# EAGLE design TapTempoMk2 (EAGLE 7.5.0)
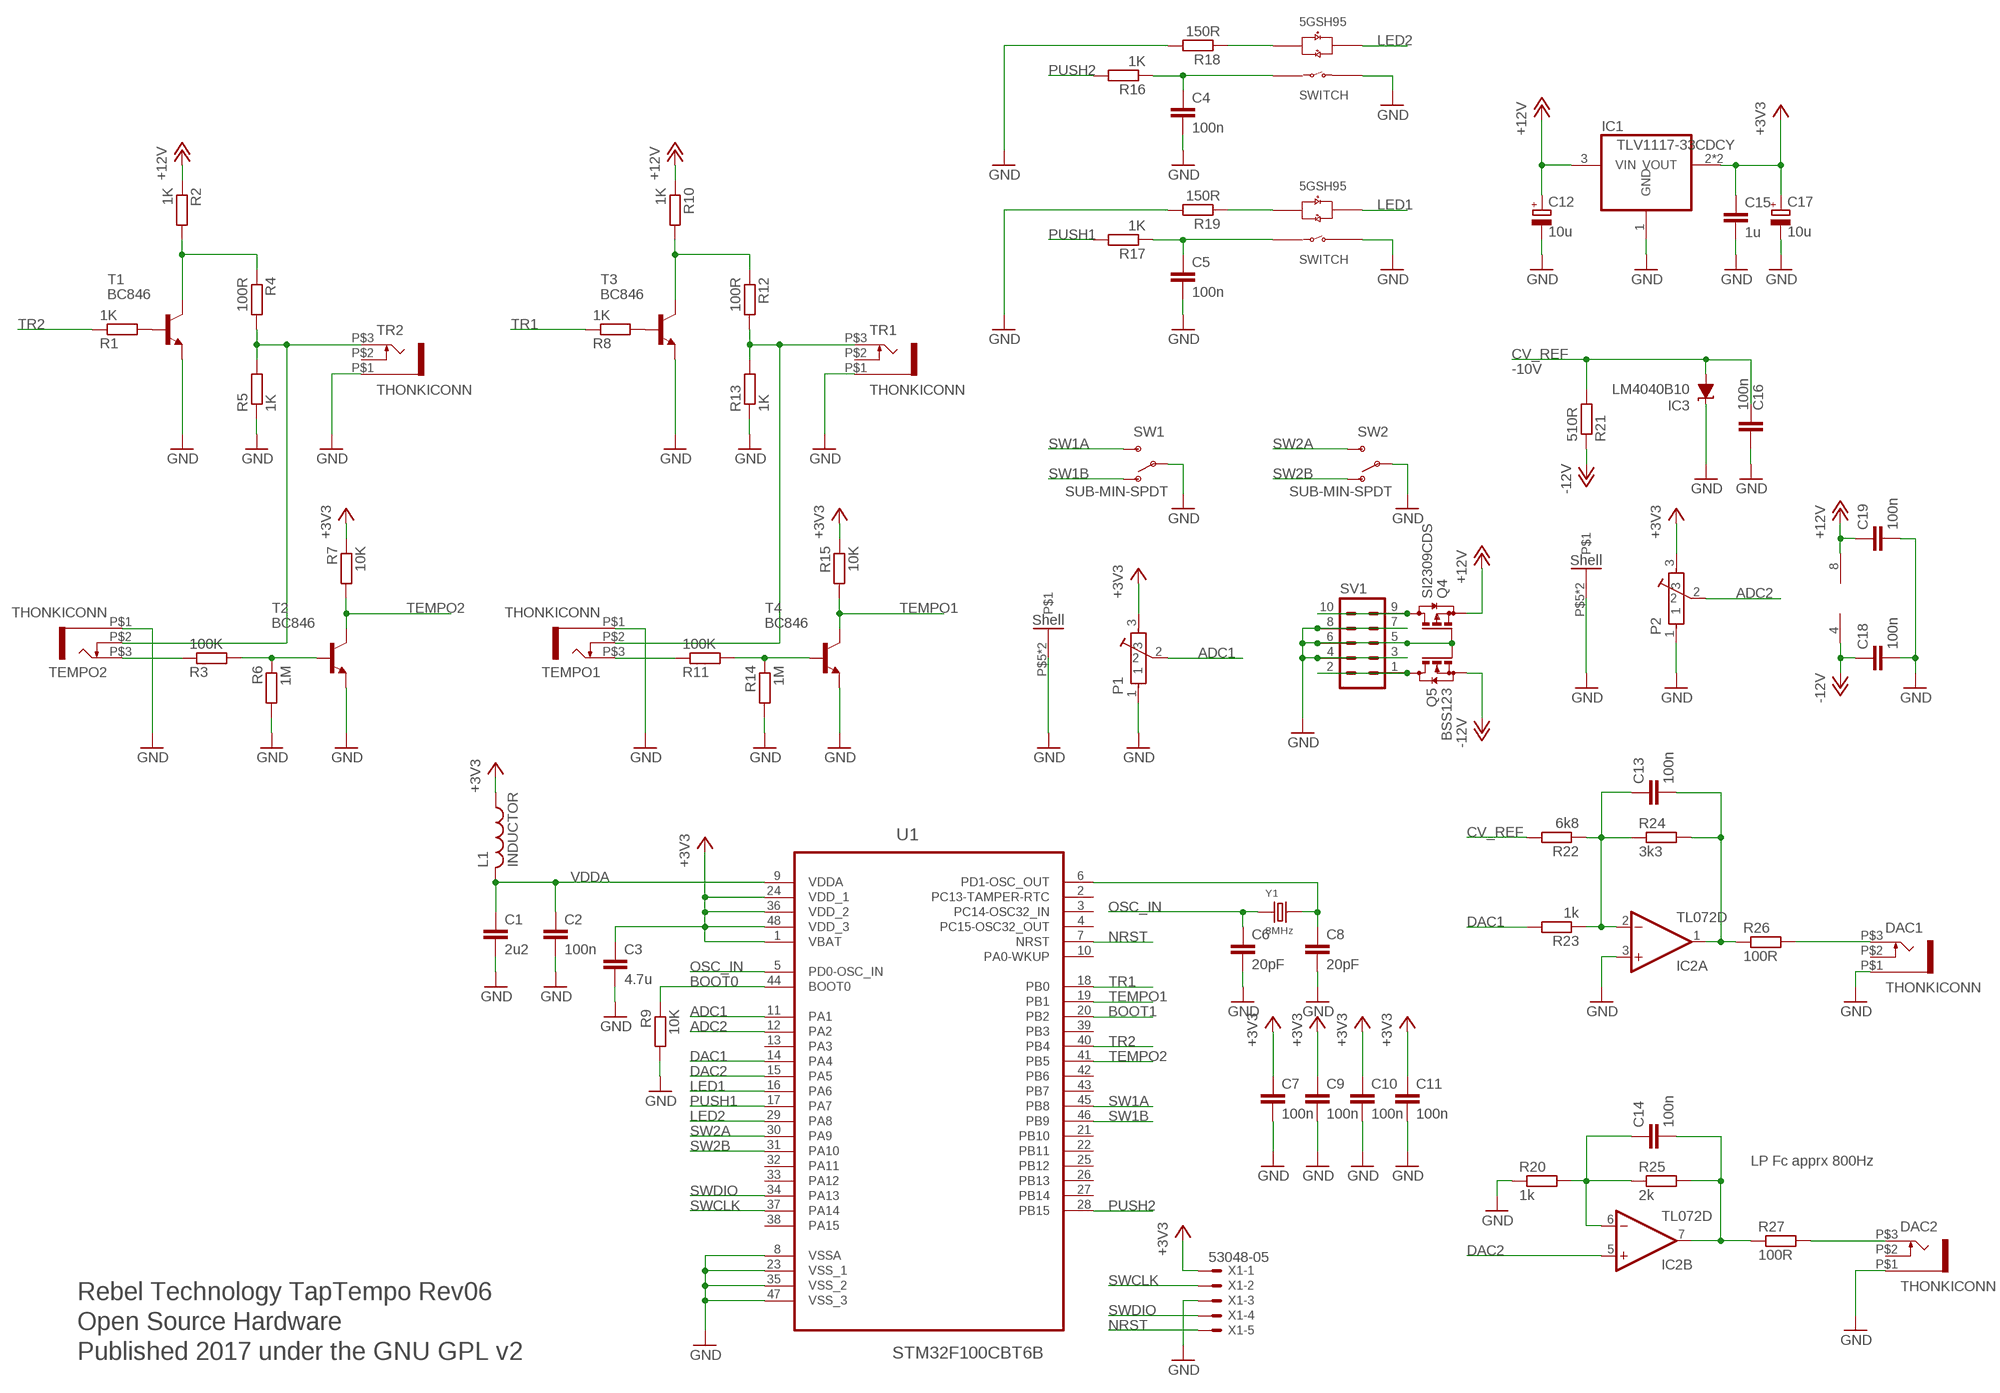
[diagram p0: schematic, sheet 1]

## Parts
C1  2u2  C-EUC0603  [C0603]
C2  100n  C-EUC0603  [C0603]
C3  4.7u  C-EUC0603  [C0603]
C4  100n  C-EUC0603  [C0603]
C5  100n  C-EUC0603  [C0603]
C6  20pF  C-EUC0603  [C0603]
C7  100n  C-EUC0603  [C0603]
C8  20pF  C-EUC0603  [C0603]
C9  100n  C-EUC0603  [C0603]
C10  100n  C-EUC0603  [C0603]
C11  100n  C-EUC0603  [C0603]
C12  10u  CPOL-EU153CLV-0405  [153CLV-0405]
C13  100n  C-EUC0603  [C0603]
C14  100n  C-EUC0603  [C0603]
C15  1u  C-EUC0603  [C0603]
C16  100n  C-EUC0603  [C0603]
C17  10u  CPOL-EU153CLV-0405  [153CLV-0405]
C18  100n  C-EUC0603  [C0603]
C19  100n  C-EUC0603  [C0603]
DAC1  THONKICONN  [THONKICONN]
DAC2  THONKICONN  [THONKICONN]
IC1  TLV1117-33CDCY  REG1117  [SOT223]
IC2  TL072D  [SO08]
IC3  LM4040B10  LM4041C12DBZ  [DBZ_R-PDSO-G3]
L1  INDUCTOR  [0603]
P1  POT-ALPS-RK09L1140  [POT-ALPS-RK09L1140]
P2  POT-ALPS-RK09L1140  [POT-ALPS-RK09L1140]
PUSH1  5GTH9  [5GTH9]
PUSH2  5GTH9  [5GTH9]
Q4  SI2309CDS  BSS84  [SOT23]
Q5  BSS123  [SOT23]
R1  1K  R-EU_0603  [0603]
R2  1K  R-EU_0603  [0603]
R3  100K  R-EU_0603  [0603]
R4  100R  R-EU_0603  [0603]
R5  1K  R-EU_0603  [0603]
R6  1M  R-EU_0603  [0603]
R7  10K  R-EU_0603  [0603]
R8  1K  R-EU_0603  [0603]
R9  10K  R-EU_0603  [0603]
R10  1K  R-EU_0603  [0603]
R11  100K  R-EU_0603  [0603]
R12  100R  R-EU_0603  [0603]
R13  1K  R-EU_0603  [0603]
R14  1M  R-EU_0603  [0603]
R15  10K  R-EU_0603  [0603]
R16  1K  R-EU_0603  [0603]
R17  1K  R-EU_0603  [0603]
R18  150R  R-EU_0603  [0603]
R19  150R  R-EU_0603  [0603]
R20  1k  R-EU_0603  [0603]
R21  510R  R-EU_0603  [0603]
R22  6k8  R-EU_0603  [0603]
R23  1k  R-EU_0603  [0603]
R24  3k3  R-EU_0603  [0603]
R25  2k  R-EU_0603  [0603]
R26  100R  R-EU_0603  [0603]
R27  100R  R-EU_0603  [0603]
SV1  MA05-2  [MA05-2]
SW1  SUB-MIN-SPDT  [SUB-MIN-SPDT]
SW2  SUB-MIN-SPDT  [SUB-MIN-SPDT]
T1  BC846  [SOT23]
T2  BC846  [SOT23]
T3  BC846  [SOT23]
T4  BC846  [SOT23]
TEMPO1  THONKICONN  [THONKICONN]
TEMPO2  THONKICONN  [THONKICONN]
TR1  THONKICONN  [THONKICONN]
TR2  THONKICONN  [THONKICONN]
U1  STM32F100CBT6B  [QFP50P900X900X160-48N]
X1  53048-05  [53048-05]
Y1  8MHz  SMD-CRYSTAL-8MHZ-20PF-20PPM(2P-5.0X3.2MM)  [X2-SMD-5.0X3.2X1.3MM]

## Nets
+3V3: C3.1 C7.1 C9.1 C10.1 C11.1 C15.1 C17.+ IC1.2(VOUT) IC1.4(VOUT) L1.1 P1.3 P2.3 R7.1 R15.1 U1.1(VBAT) U1.24(VDD_1) U1.36(VDD_2) U1.48(VDD_3) X1.1
+12V: C12.+ C19.1 IC1.3(VIN) IC2.8(P:V+) Q4.2(S) R2.1 R10.1
-12V: C18.1 IC2.4(P:V-) Q5.2(S) R21.1
ADC1: P1.2 U1.11(PA1)
ADC2: P2.2 U1.12(PA2)
BOOT0: R9.1 U1.44(BOOT0)
BOOT1: U1.20(PB2)
CV_REF: C16.1 IC3.2(A) R21.2 R22.2
DAC1: R23.2 U1.14(PA4)
DAC2: IC2.5(B:+IN) U1.15(PA5)
GND: C1.2 C2.2 C3.2 C4.2 C5.2 C6.2 C7.2 C8.2 C9.2 C10.2 C11.2 C12.- C15.2 C16.2 C17.- C18.2 C19.2 DAC1.P$1 DAC2.P$1 IC1.1(GND) IC2.3(A:+IN) IC3.1(C) P1.1 P1.P$5 P1.P$6 P2.1 P2.P$5 P2.P$6 PUSH1.1(SWITCH_B) PUSH2.1(SWITCH_B) Q4.1(G) Q5.1(G) R5.1 R6.2 R9.2 R13.1 R14.2 R18.2 R19.2 R20.1 SV1.3 SV1.4 SV1.5 SV1.6 SV1.7 SV1.8 SW1.2(P) SW2.2(P) T1.2(E) T2.2(E) T3.2(E) T4.2(E) TEMPO1.P$1 TEMPO2.P$1 TR1.P$1 TR2.P$1 U1.8(VSSA) U1.23(VSS_1) U1.35(VSS_2) U1.47(VSS_3) X1.3
LED1: PUSH1.+3(LED_R+) U1.16(PA6)
LED2: PUSH2.+3(LED_R+) U1.29(PA8)
N$1: C8.1 U1.6(PD1-OSC_OUT) Y1.2
N$2: PUSH1.-2(LED_G+) R19.1
N$3: C14.2 IC2.7(B:OUT) R25.2 R27.1
N$4: C14.1 IC2.6(B:-IN) R20.2 R25.1
N$5: R12.2 R13.2 TEMPO1.P$2 TR1.P$3
N$6: Q4.3(D) SV1.9 SV1.10
N$7: C13.2 IC2.1(A:OUT) R24.2 R26.1
N$9: PUSH2.-2(LED_G+) R18.1
N$10: R3.2 R6.1 T2.1(B)
N$11: R1.2 T1.1(B)
N$12: R2.2 R4.1 T1.3(C)
N$13: C13.1 IC2.2(A:-IN) R22.1 R23.1 R24.1
N$14: R3.1 TEMPO2.P$3
N$15: R4.2 R5.2 TEMPO2.P$2 TR2.P$3
N$16: Q5.3(D) SV1.1 SV1.2
N$17: C5.1 PUSH1.4(SWITCH_A) R17.1
N$18: C4.1 PUSH2.4(SWITCH_A) R16.1
N$23: R11.1 TEMPO1.P$3
N$27: R11.2 R14.1 T4.1(B)
N$31: DAC1.P$3 R26.2
N$32: DAC2.P$3 R27.2
N$34: R8.2 T3.1(B)
N$38: R10.2 R12.1 T3.3(C)
NRST: U1.7(NRST) X1.5
OSC_IN: C6.1 U1.5(PD0-OSC_IN) Y1.1
PUSH1: R17.2 U1.17(PA7)
PUSH2: R16.2 U1.28(PB15)
SW1A: SW1.3(S) U1.45(PB8)
SW1B: SW1.1(O) U1.46(PB9)
SW2A: SW2.3(S) U1.30(PA9)
SW2B: SW2.1(O) U1.31(PA10)
SWCLK: U1.37(PA14) X1.2
SWDIO: U1.34(PA13) X1.4
TEMPO1: R15.2 T4.3(C) U1.19(PB1)
TEMPO2: R7.2 T2.3(C) U1.41(PB5)
TR1: R8.1 U1.18(PB0)
TR2: R1.1 U1.40(PB4)
VDDA: C1.1 C2.1 L1.2 U1.9(VDDA)
Unconnected: DAC1.P$2 DAC2.P$2 TR1.P$2 TR2.P$2 U1.2(PC13-TAMPER-RTC) U1.3(PC14-OSC32_IN) U1.4(PC15-OSC32_OUT) U1.10(PA0-WKUP) U1.13(PA3) U1.21(PB10) U1.22(PB11) U1.25(PB12) U1.26(PB13) U1.27(PB14) U1.32(PA11) U1.33(PA12) U1.38(PA15) U1.39(PB3) U1.42(PB6) U1.43(PB7)

## Notes on the sheet
- -10V
- LP Fc apprx 800Hz
- Rebel Technology TapTempo Rev06
- Open Source Hardware
- Published 2017 under the GNU GPL v2

## Library data of the parts
C1-C11 C13-C16 C18 C19 = Rebel:C-EU: CAPACITOR, European symbol
C12 C17 = Rebel:CPOL-EU: POLARIZED CAPACITOR, European symbol; FARNELL: 882-3014
DAC1 DAC2 TEMPO1 TEMPO2 TR1 TR2 = Rebel:THONKICONN
IC1 = burr-brown:REG1117: 800mA and 1A Low Dropout (LDO) Positive Regulator 1.8V, 2.5V, 2.85V, 3.3V, 5V, and Adj; FARNELL: 149-4942; MPN: REG1117; OC_FARNELL: 1097566; OC_NEWARK: 14P6981
IC2 = linear:TL072: OP AMP
IC3 = texas:LM4041: PRECISION MICROPOWER SHUNT VOLTAGE REFERENCE Source: http://focus.ti.com/lit/ds/slcs146e/slcs146e.pdf; MF: TEXAS INSTRUMENT CONNECTORS; MPN: LM4041C12QDBZT; OC_FARNELL: 1771733; OC_NEWARK: 43K3376
L1 = Rebel:INDUCTOR
P1 P2 = Rebel:POT-ALPS-RK09L
PUSH1 PUSH2 = SWITCH-5GTH9:5GTH9
Q4 = transistor-small-signal:BSS84: P-CHANNEL MOS FET; OC_FARNELL: 1779264
Q5 = transistor-small-signal:BSS123: N-CHANNEL MOS FET; OC_FARNELL: 1843725
R1-R27 = Rebel:R-EU_: RESISTOR, European symbol
SV1 = con-lstb:MA05-2: PIN HEADER; OC_FARNELL: unknown; OC_NEWARK: unknown
SW1 SW2 = Rebel:SUB-MIN-SPDT
T1-T4 = transistor:BC846: NPN TRANSISTOR
U1 = Rebel:STM32F100CBT6B: ARM-based 32-bit MCU; MPN: STM32F100CBT6B; OC_FARNELL: 1838512; OC_NEWARK: 86R1308; PACKAGE: LQFP-48; SUPPLIER: STMircroelectronics
X1 = con-molex:53?-05: CONNECTOR wire to board 1.25 mm (.049 inch) pitch header; MF: MOLEX; MPN: 53048-0510; OC_FARNELL: 9732926; OC_NEWARK: 57H4722
Y1 = Seeed-OPL-crystal-osctllator:SMD-CRYSTAL-8MHZ-20PF-20PPM(2P-5.0X3.2MM): 306010004; MPN: 5032/2P; VALUE: 5032/2p

## Board
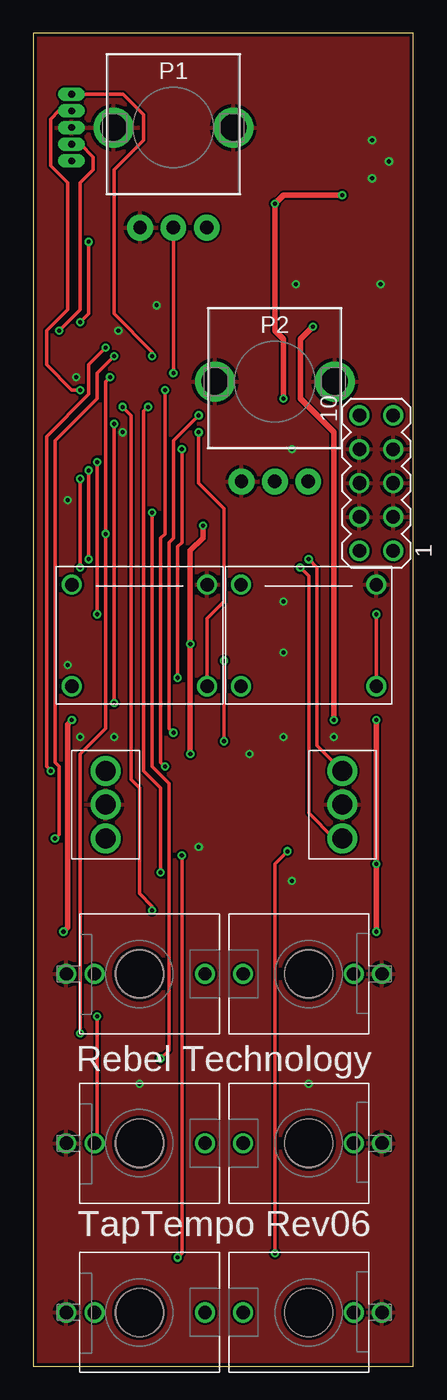
[diagram p1: board, top side]
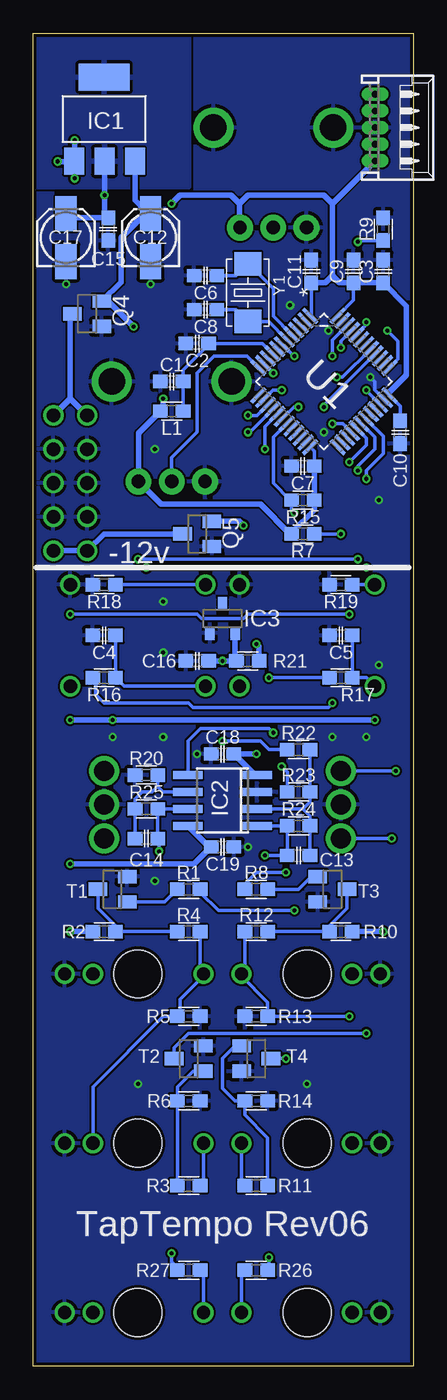
[diagram p2: board, bottom side, seen from below]

Size 28.53 x 100 mm. Coordinates in mm from the lower left corner, seen from the top.
Outline: 28.53,0 28.53,100 0,100 0,0 28.53,0
Copper layers (1*16): Top 0.035mm / dielectric 1.5mm / Bottom 0.035mm
Design rules "SeeedStudio_2layer_DRU_no_angle_20140221": minimum track width 6mil, minimum drill 12mil, track to track 6mil, track to pad 6mil, pad to pad 6mil, via to via 6mil, smd to smd 0mil, copper to edge 10mil, drill to drill 10mil, minimum pad ring 10mil, minimum via ring 6mil, stop-mask expansion 2mil, vias tented up to drill 100mil, thermal gap 10mil

### Footprints (pad centres in the part's own frame; a part is rotated, then mirrored left to right if it is on the bottom)
C0603 = smd 1.1 x 1: 1 -0.85,0; 2 0.85,0
153CLV-0405 = smd 2.6 x 1.6: + 1.8,0; - -1.8,0
THONKICONN = drill 1: P$1 0,-5.5; P$2 0,-3.38; P$3 0,4.92 | hole 3.6: 0,0
SOT223 = smd 1.499 x 2.007: 1 -2.261,-3.15; 2 0.025,-3.15; 3 2.311,-3.15 | smd 3.81 x 2.007: 4 0,3.15
SO08 = smd 0.6 x 2.2: 1 -1.905,-2.6; 2 -0.635,-2.6; 3 0.635,-2.6; 4 1.905,-2.6; 5 1.905,2.6; 6 0.635,2.6; 7 -0.635,2.6; 8 -1.905,2.6
DBZ_R-PDSO-G3 = smd 0.7 x 1: 1 -0.95,-1.1; 2 0.95,-1.1; 3 0,1.1
0603 = smd 1.1 x 1: 1 -0.85,0; 2 0.85,0
POT-ALPS-RK09L1140 = drill 1 pad 1.93: 1 -2.5,-7.5; 2 0,-7.5; 3 2.5,-7.5 | drill 2: P$5 -4.5,0; P$6 4.5,0
5GTH9 = drill 1: 1 5.08,3.81; 4 -5.08,-3.81; +3 5.08,-3.81; -2 -5.08,3.81
SOT23 = smd 1 x 1.4: 1 -0.95,-1.1; 2 0.95,-1.1; 3 0,1.1
MA05-2 = drill 1.016: 1 -5.08,-1.27; 2 -5.08,1.27; 3 -2.54,-1.27; 4 -2.54,1.27; 5 0,-1.27; 6 0,1.27; 7 2.54,-1.27; 8 2.54,1.27; 9 5.08,-1.27; 10 5.08,1.27
SUB-MIN-SPDT = drill 1.5: 1 0,-2.54; 2 0,0; 3 0,2.54
QFP50P900X900X160-48N = smd 1.473 x 0.279: 1 -4.216,2.743; 2 -4.216,2.261; 3 -4.216,1.753; 4 -4.216,1.245; 5 -4.216,0.762; 6 -4.216,0.254; 7 -4.216,-0.254; 8 -4.216,-0.762; 9 -4.216,-1.245; 10 -4.216,-1.753; 11 -4.216,-2.261; 12 -4.216,-2.743; 25 4.216,-2.743; 26 4.216,-2.261; 27 4.216,-1.753; 28 4.216,-1.245; 29 4.216,-0.762; 30 4.216,-0.254; 31 4.216,0.254; 32 4.216,0.762; 33 4.216,1.245; 34 4.216,1.753; 35 4.216,2.261; 36 4.216,2.743 | smd 0.279 x 1.473: 13 -2.743,-4.216; 14 -2.261,-4.216; 15 -1.753,-4.216; 16 -1.245,-4.216; 17 -0.762,-4.216; 18 -0.254,-4.216; 19 0.254,-4.216; 20 0.762,-4.216; 21 1.245,-4.216; 22 1.753,-4.216; 23 2.261,-4.216; 24 2.743,-4.216; 37 2.743,4.216; 38 2.261,4.216; 39 1.753,4.216; 40 1.245,4.216; 41 0.762,4.216; 42 0.254,4.216; 43 -0.254,4.216; 44 -0.762,4.216; 45 -1.245,4.216; 46 -1.753,4.216; 47 -2.261,4.216; 48 -2.743,4.216
53048-05 = drill 0.5 pad 0.698 long: 1 2.5,-1.25; 2 1.25,-1.25; 3 0,-1.25; 4 -1.25,-1.25; 5 -2.5,-1.25
X2-SMD-5.0X3.2X1.3MM = smd 1.778 x 2.032: 1 -2.159,0; 2 2.159,0

### Placement (x,y rotation side)
C1  18.14,73.88 180 bottom
C2  16.23,76.73 180 bottom
C3  2.26,82.13 90 bottom
C4  23.22,54.83 180 bottom
C5  5.44,54.83 180 bottom
C6  15.6,81.81 180 bottom
C7  8.29,67.53 180 bottom
C8  15.6,79.27 180 bottom
C9  4.48,82.13 90 bottom
C10  0.99,70.07 270 bottom
C11  7.66,82.13 90 bottom
C12  19.72,84.67 90 bottom
C13  8.61,38.32 180 bottom
C14  20.04,39.59 0 bottom
C15  22.9,85.31 270 bottom
C16  16.23,52.92 180 bottom
C17  26.07,84.67 90 bottom
C18  14.33,45.94 180 bottom
C19  14.33,38.95 0 bottom
DAC1  7.98,4.03 270 top
DAC2  20.68,4.03 90 top
IC1  23.22,93.56 0 bottom
IC2  14.33,42.44 90 bottom
IC3  14.33,56.1 0 bottom
L1  18.14,71.65 0 bottom
P1  10.52,92.93 0 top
P2  18.14,73.88 0 top
PUSH1  7.98,54.83 0 top
PUSH2  20.68,54.83 0 top
Q4  24.49,78.96 90 bottom
Q5  16.23,62.45 90 bottom
R1  16.87,35.78 180 bottom
R2  23.22,32.6 0 bottom
R3  16.87,13.55 180 bottom
R4  16.87,32.6 0 bottom
R5  16.87,26.25 180 bottom
R6  16.87,19.9 0 bottom
R7  8.29,62.45 0 bottom
R8  11.79,35.78 0 bottom
R9  2.26,85.31 90 bottom
R10  5.44,32.6 180 bottom
R11  11.79,13.55 0 bottom
R12  11.79,32.6 180 bottom
R13  11.79,26.25 0 bottom
R14  11.79,19.9 0 bottom
R15  8.29,64.99 180 bottom
R16  23.22,51.65 180 bottom
R17  5.44,51.65 180 bottom
R18  23.22,58.64 180 bottom
R19  5.44,58.64 180 bottom
R20  20.04,44.35 0 bottom
R21  12.42,52.92 180 bottom
R22  8.61,46.25 180 bottom
R23  8.61,43.08 180 bottom
R24  8.61,40.54 180 bottom
R25  20.04,41.81 0 bottom
R26  11.79,7.2 180 bottom
R27  16.87,7.2 0 bottom
SV1  25.76,66.26 90 top
SW1  5.44,42.13 0 top
SW2  23.22,42.13 0 top
T1  22.58,35.78 90 bottom
T2  16.87,23.08 90 bottom
T3  6.07,35.78 270 bottom
T4  11.79,23.08 270 bottom
TEMPO1  7.98,16.73 270 top
TEMPO2  20.68,16.73 90 top
TR1  7.98,29.43 270 top
TR2  20.68,29.43 90 top
U1  6.71,73.88 315 bottom
X1  1.63,92.93 270 bottom
Y1  12.42,80.54 270 bottom

### Tracks (layer width: path | path; a pad name or v marks a point on that pad's centre or on a via)
+3V3  (via drill 0.3)
  Top 0.406: v18.77,72.61 18.77,77.05 18.14,77.69 v18.14,87.21 18.77,87.85 v23.19,87.85
  Bottom 0.254: C11.1 7.66,78.89 U1.1 | C9.1 4.48,79.98 U1.48 | C7.1 7.44,68.65 U1.24 | 9.14,62.55 R7.1 9.25,62.45 | C10.1 0.99,72.04 U1.36 1.78,73.08
  Bottom 0.406: IC1.2 v23.19,87.85 23.19,86.18 C15.1 26.21,86.16 C17.+ | X1.1 2.88,90.41 6.07,87.21 | 6.07,87.21 6.07,81.81 | C11.1 6.6,81.28 6.07,81.81 | 6.07,81.81 5.54,81.28 C9.1 C3.1 0.51,79.53 0.51,74.35 1.78,73.08 | C7.1 R15.1 7.44,64.25 9.14,62.55 | v18.77,72.61 18.77,71.87 L1.1 20.64,70 P2.3 18.93,64.67 11.47,64.67 9.25,62.45 | 6.07,87.21 6.71,87.85 12.42,87.85 13.06,87.21 | 13.06,87.21 13.06,85.47 P1.3 | v18.14,87.21 17.5,87.85 13.69,87.85 13.06,87.21
  pour Bottom: 16.87,99.91 16.87,88.48 29.57,88.48 29.57,99.91
+12V  (via drill 0.3)
  Top 0.406: v20.99,78 20.04,77.05 20.04,72.61 22.58,70.07 v22.58,48.48 | v2.9,48.48 2.58,48.16 2.58,32.92 v2.26,32.6 | v25.76,48.48 v25.76,37.68 v25.76,32.6
  Bottom 0.254: IC2.8 17.18,40.54
  Bottom 0.406: IC1.3 20.9,87.47 20.15,86.71 20.15,86.47 | 20.15,86.47 21.95,84.67 21.95,81.35 Q4.2 22.9,79.91 v20.99,78 | v2.9,48.48 v22.58,48.48 v25.76,48.48 | v25.76,32.6 R2.1 | v2.26,32.6 R10.1 | IC2.8 15.34,38.95 C19.1 16.45,37.68 v25.76,37.68 | C12.+ 20.15,86.47
-12V  (via drill 0.3)
  Top 0.406: v11.79,45.94 v11.79,54.19 11.79,61.18 12.74,62.13 v12.74,63.08
  Bottom 0.406: R21.1 11.57,53.98 v11.79,54.19 | v11.79,45.94 C18.1 11.89,44.35 IC2.4 | Q5.2 13.05,63.4 v12.74,63.08
ADC1  (via drill 0.3)
  Top 0.254: P1.2 v10.52,74.51
  Bottom 0.254: v10.52,74.51 10.54,74.51 U1.11
ADC2
  Bottom 0.254: P2.2 18.14,68.16 16.23,70.07 16.23,74.51 14.96,75.78 12.49,75.78 U1.12
BOOT0  (via drill 0.3)
  Top 0.254: v4.17,84.35 4.17,78.96 v3.53,78.32
  Bottom 0.254: R9.1 4.06,84.46 v4.17,84.35 | v3.53,78.32 3.53,78.13 U1.44
CV_REF  (via drill 0.3)
  Top 0.254: v14.33,46.89 v14.33,52.92
  Bottom 0.254: 13.38,53.03 R21.2 | R22.2 10.83,46.25 11.47,46.89 v14.33,46.89
  Bottom 0.406: R21.2 v14.33,52.92 C16.1 | IC3.2 13.38,53.03
DAC1  (via drill 0.3)
  Top 0.254: v9.88,44.98 9.56,45.3 9.56,62.13 9.88,62.45 v9.88,73.24
  Bottom 0.254: R23.2 9.46,44.56 v9.88,44.98 | v9.88,73.24 10.54,73.24 U1.14
DAC2  (via drill 0.3)
  Top 0.254: v10.52,47.52 10.2,47.84 10.2,61.81 10.52,62.13 10.52,69.43 v12.42,71.34
  Bottom 0.254: v12.42,71.34 11.72,71.34 U1.15 | v10.52,47.52 10.83,47.84 15.97,47.84 16.93,46.89 IC2.5
GND  (via drill 0.3)
  Bottom 0.254: U1.35 2.15,72.49 2.9,73.24 2.9,73.88 v3.21,74.19
  Bottom 0.406: 26.71,90.41 v26.71,90.39 25.44,90.39 | IC1.1 25.44,90.41 | 25.44,90.41 25.44,90.39 | 25.44,90.39 v25.44,89.12 | 25.44,90.41 v25.44,91.97
  other vias: 19.72,81.18 26.07,81.18 19.41,68.8 18.77,47.21 22.58,47.21 18.77,53.56 18.77,57.37 19.41,36.41 20.68,21.17 7.98,21.17 6.39,77.69 9.25,79.59 6.71,70.07 2.58,52.6 3.53,47.21 6.07,47.21 2.58,64.99 16.23,45.94 12.42,38.95
  pour Bottom (rank 2): 29.57,-1.05 -1.55,-1.05 -1.55,99.91 29.57,99.91
  pour Top: 30.2,-1.05 -0.91,-1.05 -0.91,99.91 30.2,99.91
LED1  (via drill 0.3)
  Top 0.254: PUSH1.+3 13.06,56.1 14.33,57.37 14.33,64.35 12.42,66.26 v12.42,70.07
  Bottom 0.254: v12.42,70.07 12.28,70.07 U1.16
LED2  (via drill 0.3)
  Top 0.254: PUSH2.+3 v25.76,56.41 | v4.8,56.41 v4.8,67.84
  Bottom 0.254: v25.76,56.41 16.23,56.41 15.91,56.1 12.74,56.1 12.42,56.41 v4.8,56.41 | v4.8,67.84 3.53,69.11 3.53,69.62 U1.29
N$1
  Bottom 0.254: U1.6 10.85,78.38 Y1.2 13.31,79.27 C8.1
N$2
  Bottom 0.254: PUSH1.-2 R19.1
N$3  (via drill 0.3)
  Top 0.254: v18.14,8.47 18.14,37.68 v19.09,38.63
  Bottom 0.254: IC2.7 R25.2 C14.2 19.09,39.48 v19.09,38.63 | R27.1 17.72,7.42 18.14,7.84 v18.14,8.47
N$4
  Bottom 0.254: IC2.6 18.77,43.08 19.19,43.5 | C14.1 R25.1 20.89,42.55 20.36,43.08 19.61,43.08 19.19,43.5 | R20.2 19.19,43.5
N$5  (via drill 0.3)
  Top 0.254: v4.8,26.25 4.8,16.93 TEMPO1.P$2
  Bottom 0.254: R12.2 12.64,29.69 TR1.P$3 12.9,29.27 10.94,27.31 R13.2 v4.8,26.25
N$6
  Bottom 0.406: 25.76,72.61 SV1.9 | SV1.10 25.76,72.61 | 25.76,72.61 25.76,78.79 Q4.3
N$7  (via drill 0.3)
  Top 0.254: v10.83,8.15 11.15,8.47 v11.15,38.32
  Bottom 0.254: 11.73,40.48 IC2.1 R24.2 C13.2 v11.15,38.32 | R26.1 10.94,7.42 10.83,7.52 v10.83,8.15
N$9
  Bottom 0.254: PUSH2.-2 R18.1
N$10
  Bottom 0.254: R3.2 R6.1 17.72,20.96 16.55,22.13 T2.1
N$11
  Bottom 0.254: T1.1 18.67,34.83 R1.2
N$12
  Bottom 0.254: R4.1 R2.2 22.37,33.02 23.68,34.34 T1.3
N$13
  Bottom 0.254: IC2.2 8.29,41.81 | 8.29,41.81 7.76,41.28 R24.1 C13.1 | 8.29,41.81 7.76,42.34 R23.1 R22.1
N$14
  Bottom 0.254: TEMPO2.P$3 15.76,13.81 R3.1
N$15
  Bottom 0.254: R4.2 16.02,29.69 TR2.P$3 15.76,29.27 17.5,27.52 17.5,26.47 R5.2 18.77,26.25 24.06,20.97 TEMPO2.P$2
N$16
  Bottom 0.406: SV1.1 SV1.2 23.22,62.45 Q5.3
N$17
  Bottom 0.254: C5.1 R17.1 3.53,51.65 PUSH1.4
N$18
  Bottom 0.254: C4.1 R16.1 21.73,51.02 PUSH2.4
N$23
  Bottom 0.254: TEMPO1.P$3 12.9,13.81 R11.1
N$27
  Bottom 0.254: R11.2 10.94,17.15 12.64,18.85 R14.1 13.37,19.9 14.33,20.85 14.33,23.08 13.38,24.03 T4.1
N$31
  Bottom 0.254: DAC1.P$3 12.9,6.94 R26.2
N$32
  Bottom 0.254: DAC2.P$3 15.76,6.94 R27.2
N$34
  Bottom 0.254: 10.62,36.09 R8.2 8.61,35.78 7.66,36.73 T3.1
N$38
  Bottom 0.254: R12.1 R10.2 6.29,33.02 4.97,34.34 T3.3
NRST  (via drill 0.3)
  Top 0.254: X1.5 6.75,95.43 8.29,93.88 8.29,91.97 6.07,89.75 6.07,78.96 8.93,76.1 v8.93,75.78
  Bottom 0.254: v8.93,75.78 8.97,75.78 U1.7
OSC_IN
  Bottom 0.254: U1.5 10.52,78.76 10.52,80.86 12.36,82.7 Y1.1 13.31,81.81 C6.1
PUSH1  (via drill 0.3)
  Top 0.254: v10.83,51.65 10.83,61.49 11.15,61.81 v11.15,68.8
  Bottom 0.254: R17.2 v10.83,51.65 | v11.15,68.8 11.15,70.51 U1.17
PUSH2  (via drill 0.3)
  Top 0.254: v6.07,70.7 v6.07,49.75
  Bottom 0.254: v6.07,49.75 6.39,49.43 16.55,49.43 16.87,49.75 23.22,49.75 23.85,50.38 23.85,51.44 R16.2 | v6.07,70.7 5.29,70.7 U1.28
SW1A  (via drill 0.3)
  Top 0.254: v1.31,44.67 0.99,44.98 0.99,69.75 4.17,72.92 4.17,75.15 v5.44,76.42
  Bottom 0.254: SW1.3 v1.31,44.67 | v5.44,76.42 5.44,76.91 U1.45
SW1B  (via drill 0.3)
  Top 0.254: v1.63,39.59 1.94,39.9 1.94,44.98 1.63,45.3 1.63,69.43 4.8,72.61 4.8,74.51 v6.07,75.78
  Bottom 0.254: SW1.1 v1.63,39.59 | v6.07,75.78 6.07,76.99 U1.46
SW2A  (via drill 0.3)
  Top 0.254: SW2.3 21.31,46.57 21.31,59.91 v20.68,60.54 | v4.17,60.54 v4.17,67.21
  Bottom 0.254: v20.68,60.54 v4.17,60.54 | v4.17,67.21 4.17,67.53 2.9,68.8 2.9,69.71 U1.30
SW2B  (via drill 0.3)
  Top 0.254: SW2.1 22.58,39.59 20.68,41.49 20.68,59.27 v20.04,59.91 | v3.53,59.91 v3.53,66.57
  Bottom 0.254: v20.04,59.91 v3.53,59.91 | v3.53,66.57 3.53,67.21 2.26,68.48 2.26,69.79 U1.31
SWCLK  (via drill 0.3)
  Top 0.254: X1.2 3.55,91.68 4.48,90.7 4.48,89.75 3.53,88.8 3.53,79.27 v1.94,77.69
  Bottom 0.254: v1.94,77.69 1.15,76.89 1.15,75.55 U1.37
SWDIO  (via drill 0.3)
  Top 0.254: X1.4 1.92,94.18 1.31,93.56 1.31,90.07 2.58,88.8 2.58,79.27 0.99,77.69 0.99,75.15 2.9,73.24 v3.53,73.24
  Bottom 0.254: U1.34 3.53,73.18 v3.53,73.24
TEMPO1  (via drill 0.3)
  Top 0.254: v8.93,64.03 8.93,44.98 10.2,43.71 10.2,23.71 v9.56,23.08
  Bottom 0.254: T4.3 v9.56,23.08 | U1.19 10.52,69.71 10.52,66.26 9.25,64.99 R15.2 9.14,64.14 v8.93,64.03
TEMPO2  (via drill 0.3)
  Top 0.254: v5.75,74.19 5.44,73.88 v5.44,62.45 5.44,47.84 3.53,45.94 v3.53,24.98
  Bottom 0.254: v5.75,74.19 5.31,74.19 U1.41 | v3.53,24.98 16.87,24.98 17.97,23.88 T2.3 | R7.2 v5.44,62.45
TR1  (via drill 0.3)
  Top 0.254: v9.56,37.05 9.56,43.4 8.29,44.67 8.29,71.65 v8.61,71.97
  Bottom 0.254: v8.61,71.97 8.97,71.97 U1.18 | R8.1 12.64,36.2 11.79,37.05 v9.56,37.05
TR2  (via drill 0.3)
  Top 0.254: v8.93,34.19 8.93,34.51 7.98,35.46 7.98,43.4 7.34,44.03 7.34,71.34 v6.71,71.97
  Bottom 0.254: R1.1 16.02,35.56 14.64,34.19 v8.93,34.19 | v6.71,71.97 6.71,72.12 U1.40
VDDA
  Bottom 0.254: U1.9 11.32,76.73 C2.1 15.38,76.63 17.29,74.73 C1.1 L1.2

### Text on the board
tPlace: Rebel Technology | TapTempo Rev06
bPlace: -12v | TapTempo Rev06